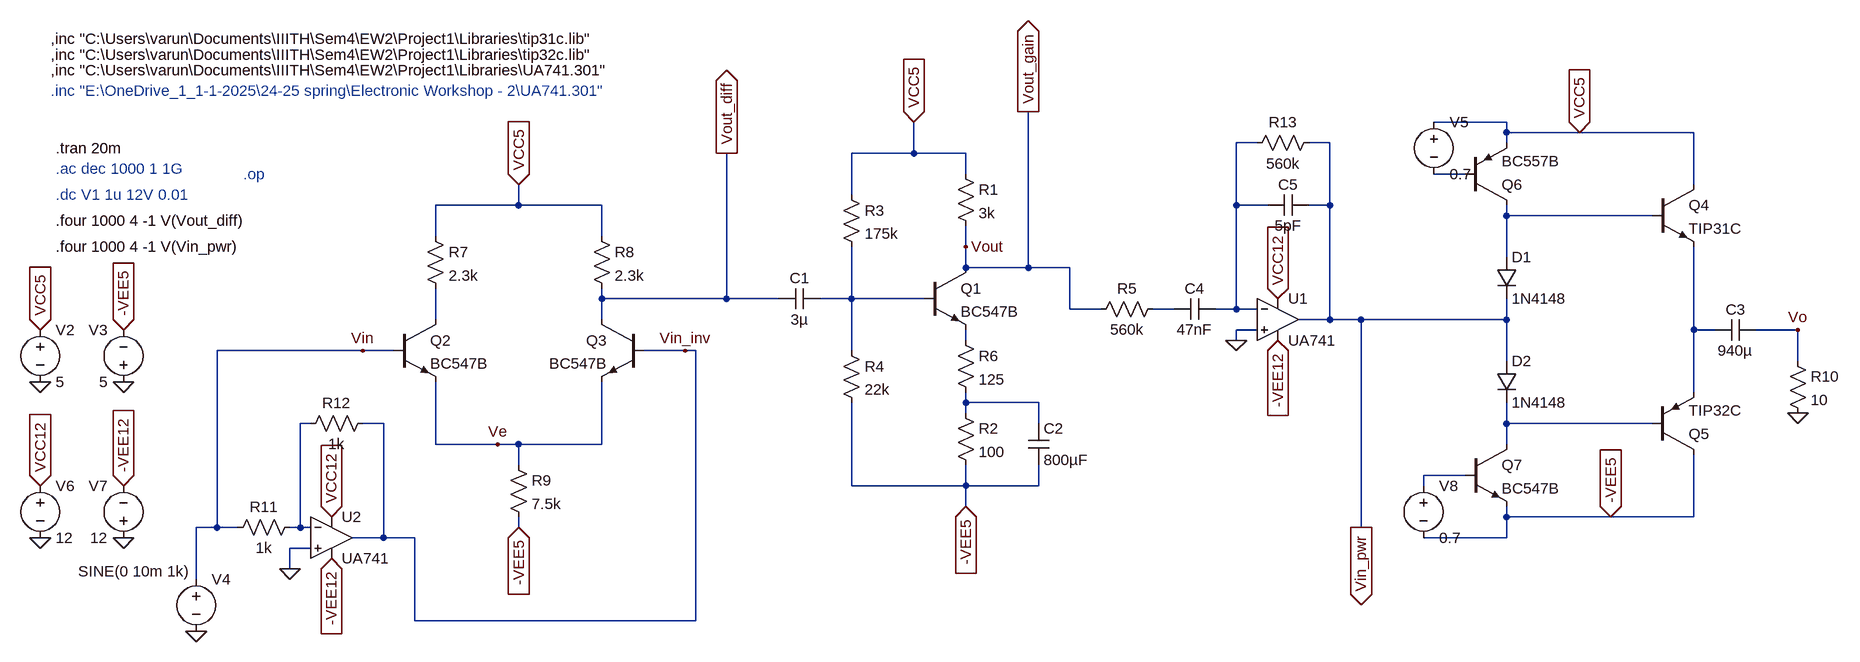
[diagram p0: schematic Full_Circuit.asc]
Full_Circuit.asc, the LTspice schematic file:
Version 4
SHEET 1 3268 888
WIRE 2256 -128 2144 -128
WIRE 2256 -112 2256 -128
WIRE 2368 -112 2256 -112
WIRE 2544 -112 2368 -112
WIRE 1872 -96 1840 -96
WIRE 1984 -96 1952 -96
WIRE 2256 -96 2256 -112
WIRE 1344 -80 1344 -128
WIRE 1344 -80 1248 -80
WIRE 1424 -80 1344 -80
WIRE 1424 -48 1424 -80
WIRE 2192 -48 2144 -48
WIRE 2544 -32 2544 -112
WIRE 1248 -16 1248 -80
WIRE 736 0 736 -32
WIRE 736 0 608 0
WIRE 864 0 736 0
WIRE 1840 0 1840 -96
WIRE 1888 0 1840 0
WIRE 1984 0 1984 -96
WIRE 1984 0 1952 0
WIRE 2256 16 2256 0
WIRE 2480 16 2256 16
WIRE 608 48 608 0
WIRE 864 48 864 0
WIRE 1424 64 1424 32
WIRE 2256 80 2256 16
WIRE 1424 96 1424 64
WIRE 1520 96 1520 -144
WIRE 1520 96 1424 96
WIRE 1584 96 1520 96
WIRE 864 144 864 128
WIRE 1056 144 1056 -80
WIRE 1056 144 864 144
WIRE 1136 144 1056 144
WIRE 1248 144 1248 64
WIRE 1248 144 1200 144
WIRE 1360 144 1248 144
WIRE 1584 160 1584 96
WIRE 1632 160 1584 160
WIRE 1744 160 1712 160
WIRE 1840 160 1840 0
WIRE 1840 160 1808 160
WIRE 1872 160 1840 160
WIRE 608 176 608 128
WIRE 864 176 864 144
WIRE 1984 176 1984 0
WIRE 1984 176 1936 176
WIRE 2032 176 1984 176
WIRE 2256 176 2256 144
WIRE 2256 176 2032 176
WIRE 1872 192 1840 192
WIRE 2544 192 2544 64
WIRE 2576 192 2544 192
WIRE 2704 192 2640 192
WIRE 1424 208 1424 192
WIRE 1840 208 1840 192
WIRE 496 224 272 224
WIRE 544 224 496 224
WIRE 992 224 928 224
WIRE 1008 224 992 224
WIRE 1248 224 1248 144
WIRE 2256 240 2256 176
WIRE 2704 240 2704 192
WIRE 2544 288 2544 192
WIRE 1424 304 1424 288
WIRE 1536 304 1424 304
WIRE 1424 320 1424 304
WIRE 416 336 400 336
WIRE 528 336 496 336
WIRE 1536 336 1536 304
WIRE 2256 336 2256 304
WIRE 2480 336 2256 336
WIRE 608 368 608 272
WIRE 704 368 608 368
WIRE 736 368 704 368
WIRE 864 368 864 272
WIRE 864 368 736 368
WIRE 2256 368 2256 336
WIRE 736 400 736 368
WIRE 2192 416 2128 416
WIRE 1248 432 1248 304
WIRE 1424 432 1424 400
WIRE 1424 432 1248 432
WIRE 1536 432 1536 400
WIRE 1536 432 1424 432
WIRE 2128 432 2128 416
WIRE 1424 464 1424 432
WIRE 2256 480 2256 464
WIRE 2416 480 2256 480
WIRE 2544 480 2544 384
WIRE 2544 480 2416 480
WIRE 272 496 272 224
WIRE 272 496 240 496
WIRE 304 496 272 496
WIRE 400 496 400 336
WIRE 400 496 384 496
WIRE 416 496 400 496
WIRE 736 496 736 480
WIRE 2032 496 2032 176
WIRE 528 512 528 336
WIRE 528 512 480 512
WIRE 576 512 528 512
WIRE 2256 512 2256 480
WIRE 2256 512 2128 512
WIRE 416 528 384 528
WIRE 384 560 384 528
WIRE 240 576 240 496
WIRE 576 640 576 512
WIRE 1008 640 1008 224
WIRE 1008 640 576 640
FLAG 1424 64 Vout
FLAG 496 224 Vin
FLAG 992 224 Vin_inv
FLAG 704 368 Ve
FLAG 128 272 0
FLAG 0 272 0
FLAG 0 192 VCC5
IOPIN 0 192 In
FLAG 128 192 -VEE5
IOPIN 128 192 In
FLAG 736 496 -VEE5
IOPIN 736 496 In
FLAG 736 -32 VCC5
IOPIN 736 -32 In
FLAG 0 432 VCC12
IOPIN 0 432 In
FLAG 128 512 0
FLAG 0 512 0
FLAG 128 432 -VEE12
IOPIN 128 432 In
FLAG 1904 144 VCC12
IOPIN 1904 144 In
FLAG 1904 208 -VEE12
IOPIN 1904 208 In
FLAG 1840 208 0
FLAG 2032 496 Vin_pwr
IOPIN 2032 496 Out
FLAG 1344 -128 VCC5
IOPIN 1344 -128 In
FLAG 1424 464 -VEE5
IOPIN 1424 464 In
FLAG 1056 -80 Vout_diff
IOPIN 1056 -80 Out
FLAG 1520 -144 Vout_gain
IOPIN 1520 -144 Out
FLAG 384 560 0
FLAG 448 544 -VEE12
IOPIN 448 544 In
FLAG 448 480 VCC12
IOPIN 448 480 In
FLAG 240 656 0
FLAG 2704 320 0
FLAG 2704 192 Vo
FLAG 2368 -112 VCC5
IOPIN 2368 -112 In
FLAG 2416 480 -VEE5
IOPIN 2416 480 In
SYMBOL npn 1360 96 R0
SYMATTR InstName Q1
SYMATTR Value BC547B
SYMBOL res 1408 -64 R0
SYMATTR InstName R1
SYMATTR Value 3k
SYMBOL res 1408 304 R0
SYMATTR InstName R2
SYMATTR Value 100
SYMBOL res 1232 -32 R0
SYMATTR InstName R3
SYMATTR Value 175k
SYMBOL res 1232 208 R0
SYMATTR InstName R4
SYMATTR Value 22k
SYMBOL cap 1200 128 R90
WINDOW 0 0 32 VBottom 2
WINDOW 3 32 32 VTop 2
SYMATTR InstName C1
SYMATTR Value 3µ
SYMBOL res 1408 192 R0
SYMATTR InstName R6
SYMATTR Value 125
SYMBOL cap 1520 336 R0
SYMATTR InstName C2
SYMATTR Value 800µF
SYMBOL res 592 32 R0
SYMATTR InstName R7
SYMATTR Value 2.3k
SYMBOL res 848 32 R0
SYMATTR InstName R8
SYMATTR Value 2.3k
SYMBOL npn 544 176 R0
SYMATTR InstName Q2
SYMATTR Value BC547B
SYMBOL npn 928 176 M0
SYMATTR InstName Q3
SYMATTR Value BC547B
SYMBOL res 720 384 R0
SYMATTR InstName R9
SYMATTR Value 7.5k
SYMBOL voltage 0 176 R0
SYMATTR InstName V2
SYMATTR Value 5
SYMBOL voltage 128 288 R180
WINDOW 0 24 96 Left 2
WINDOW 3 24 16 Left 2
SYMATTR InstName V3
SYMATTR Value 5
SYMBOL voltage 240 560 R0
WINDOW 123 24 44 Left 2
WINDOW 39 0 0 Left 0
WINDOW 3 -182 4 Left 2
SYMATTR Value SINE(0 10m 1k)
SYMATTR InstName V4
SYMBOL OpAmps\\opamp2 1904 112 R0
SYMATTR InstName U1
SYMATTR Value UA741
SYMBOL voltage 0 416 R0
SYMATTR InstName V6
SYMATTR Value 12
SYMBOL voltage 128 528 R180
WINDOW 0 24 96 Left 2
WINDOW 3 24 16 Left 2
SYMATTR InstName V7
SYMATTR Value 12
SYMBOL cap 1952 -16 R90
WINDOW 0 0 32 VBottom 2
WINDOW 3 32 32 VTop 2
SYMATTR InstName C5
SYMATTR Value 5pF
SYMBOL res 1968 -112 R90
WINDOW 0 0 56 VBottom 2
WINDOW 3 32 56 VTop 2
SYMATTR InstName R13
SYMATTR Value 560k
SYMBOL OpAmps\\opamp2 448 448 R0
SYMATTR InstName U2
SYMATTR Value UA741
SYMBOL res 400 480 R90
WINDOW 0 0 56 VBottom 2
WINDOW 3 32 56 VTop 2
SYMATTR InstName R11
SYMATTR Value 1k
SYMBOL res 512 320 R90
WINDOW 0 0 56 VBottom 2
WINDOW 3 32 56 VTop 2
SYMATTR InstName R12
SYMATTR Value 1k
SYMBOL diode 2240 80 R0
SYMATTR InstName D1
SYMATTR Value 1N4148
SYMBOL diode 2240 240 R0
SYMATTR InstName D2
SYMATTR Value 1N4148
SYMBOL npn 2480 -32 R0
SYMATTR InstName Q4
SYMATTR Value TIP31C
SYMBOL pnp 2480 384 M180
SYMATTR InstName Q5
SYMATTR Value TIP32C
SYMBOL res 2688 224 R0
SYMATTR InstName R10
SYMATTR Value 10
SYMBOL cap 2640 176 R90
WINDOW 0 0 32 VBottom 2
WINDOW 3 32 32 VTop 2
SYMATTR InstName C3
SYMATTR Value 940µ
SYMBOL pnp 2192 0 M180
SYMATTR InstName Q6
SYMATTR Value BC557B
SYMBOL voltage 2144 -144 R0
SYMATTR InstName V5
SYMATTR Value 0.7
SYMBOL npn 2192 368 R0
SYMATTR InstName Q7
SYMATTR Value BC547B
SYMBOL voltage 2128 416 R0
WINDOW 123 0 0 Left 0
WINDOW 39 0 0 Left 0
SYMATTR InstName V8
SYMATTR Value 0.7
SYMBOL cap 1808 144 R90
WINDOW 0 0 32 VBottom 2
WINDOW 3 32 32 VTop 2
SYMATTR InstName C4
SYMATTR Value 47nF
SYMBOL res 1728 144 R90
WINDOW 0 0 56 VBottom 2
WINDOW 3 32 56 VTop 2
SYMATTR InstName R5
SYMATTR Value 560k
TEXT 24 -16 Left 2 ;.dc V1 1u 12V 0.01
TEXT 24 24 Left 2 !.four 1000 4 -1 V(Vout_diff)
TEXT 312 -48 Left 2 ;.op
TEXT 24 -88 Left 2 !.tran 20m
TEXT 24 -56 Left 2 ;.ac dec 1000 1 1G
TEXT 16 -176 Left 2 ;.inc "E:\\OneDrive_1_1-1-2025\\24-25 spring\\Electronic Workshop - 2\\UA741.301"
TEXT 16 -208 Left 2 !,inc "C:\\Users\\varun\\Documents\\IIITH\\Sem4\\EW2\\Project1\\Libraries\\UA741.301"
TEXT 24 64 Left 2 !.four 1000 4 -1 V(Vin_pwr)
TEXT 16 -232 Left 2 !,inc "C:\\Users\\varun\\Documents\\IIITH\\Sem4\\EW2\\Project1\\Libraries\\tip32c.lib"
TEXT 16 -256 Left 2 !,inc "C:\\Users\\varun\\Documents\\IIITH\\Sem4\\EW2\\Project1\\Libraries\\tip31c.lib"

The netlist it stands for:
* Full_Circuit.asc
Q1 Vout_gain N004 N008 0 BC547B
R1 VCC5 Vout_gain 3k
R2 N009 -VEE5 100
R3 VCC5 N004 175k
R4 N004 -VEE5 22k
C1 N004 Vout_diff 3µ
R6 N008 N009 125
C2 N009 -VEE5 800µF
R7 VCC5 N006 2.3k
R8 VCC5 Vout_diff 2.3k
Q2 N006 Vin Ve 0 BC547B
Q3 Vout_diff Vin_inv Ve 0 BC547B
R9 Ve -VEE5 7.5k
V2 VCC5 0 5
V3 0 -VEE5 5
V4 Vin 0 SINE(0 10m 1k)
XU1 0 N001 VCC12 -VEE12 Vin_pwr UA741  ; pins In+ In- V+ V- OUT
V6 VCC12 0 12
V7 0 -VEE12 12
C5 Vin_pwr N001 5pF
R13 Vin_pwr N001 560k
XU2 0 N010 VCC12 -VEE12 Vin_inv UA741  ; pins In+ In- V+ V- OUT
R11 N010 Vin 1k
R12 Vin_inv N010 1k
D1 N003 Vin_pwr 1N4148
D2 Vin_pwr N011 1N4148
Q4 VCC5 N003 N007 0 TIP31C
Q5 -VEE5 N011 N007 0 TIP32C
R10 Vo 0 10
C3 Vo N007 940µ
Q6 N003 N002 VCC5 0 BC557B
V5 VCC5 N002 0.7
Q7 N011 N012 -VEE5 0 BC547B
V8 N012 -VEE5 0.7
C4 N001 N005 47nF
R5 N005 Vout_gain 560k
.model D D
.lib standard.dio
.model NPN NPN
.model PNP PNP
.lib standard.bjt
* .dc V1 1u 12V 0.01
.four 1000 4 -1 V(Vout_diff)
* .op
.tran 20m
* .ac dec 1000 1 1G
* .inc "E:\OneDrive_1_1-1-2025\24-25 spring\Electronic Workshop - 2\UA741.301"
,inc "C:\Users\varun\Documents\IIITH\Sem4\EW2\Project1\Libraries\UA741.301"
.four 1000 4 -1 V(Vin_pwr)
,inc "C:\Users\varun\Documents\IIITH\Sem4\EW2\Project1\Libraries\tip32c.lib"
,inc "C:\Users\varun\Documents\IIITH\Sem4\EW2\Project1\Libraries\tip31c.lib"
.backanno
.end